# EAGLE design breakout_tag (EAGLE 5.11)
ABBREV: jn5; PROJECT: JeeNode v5
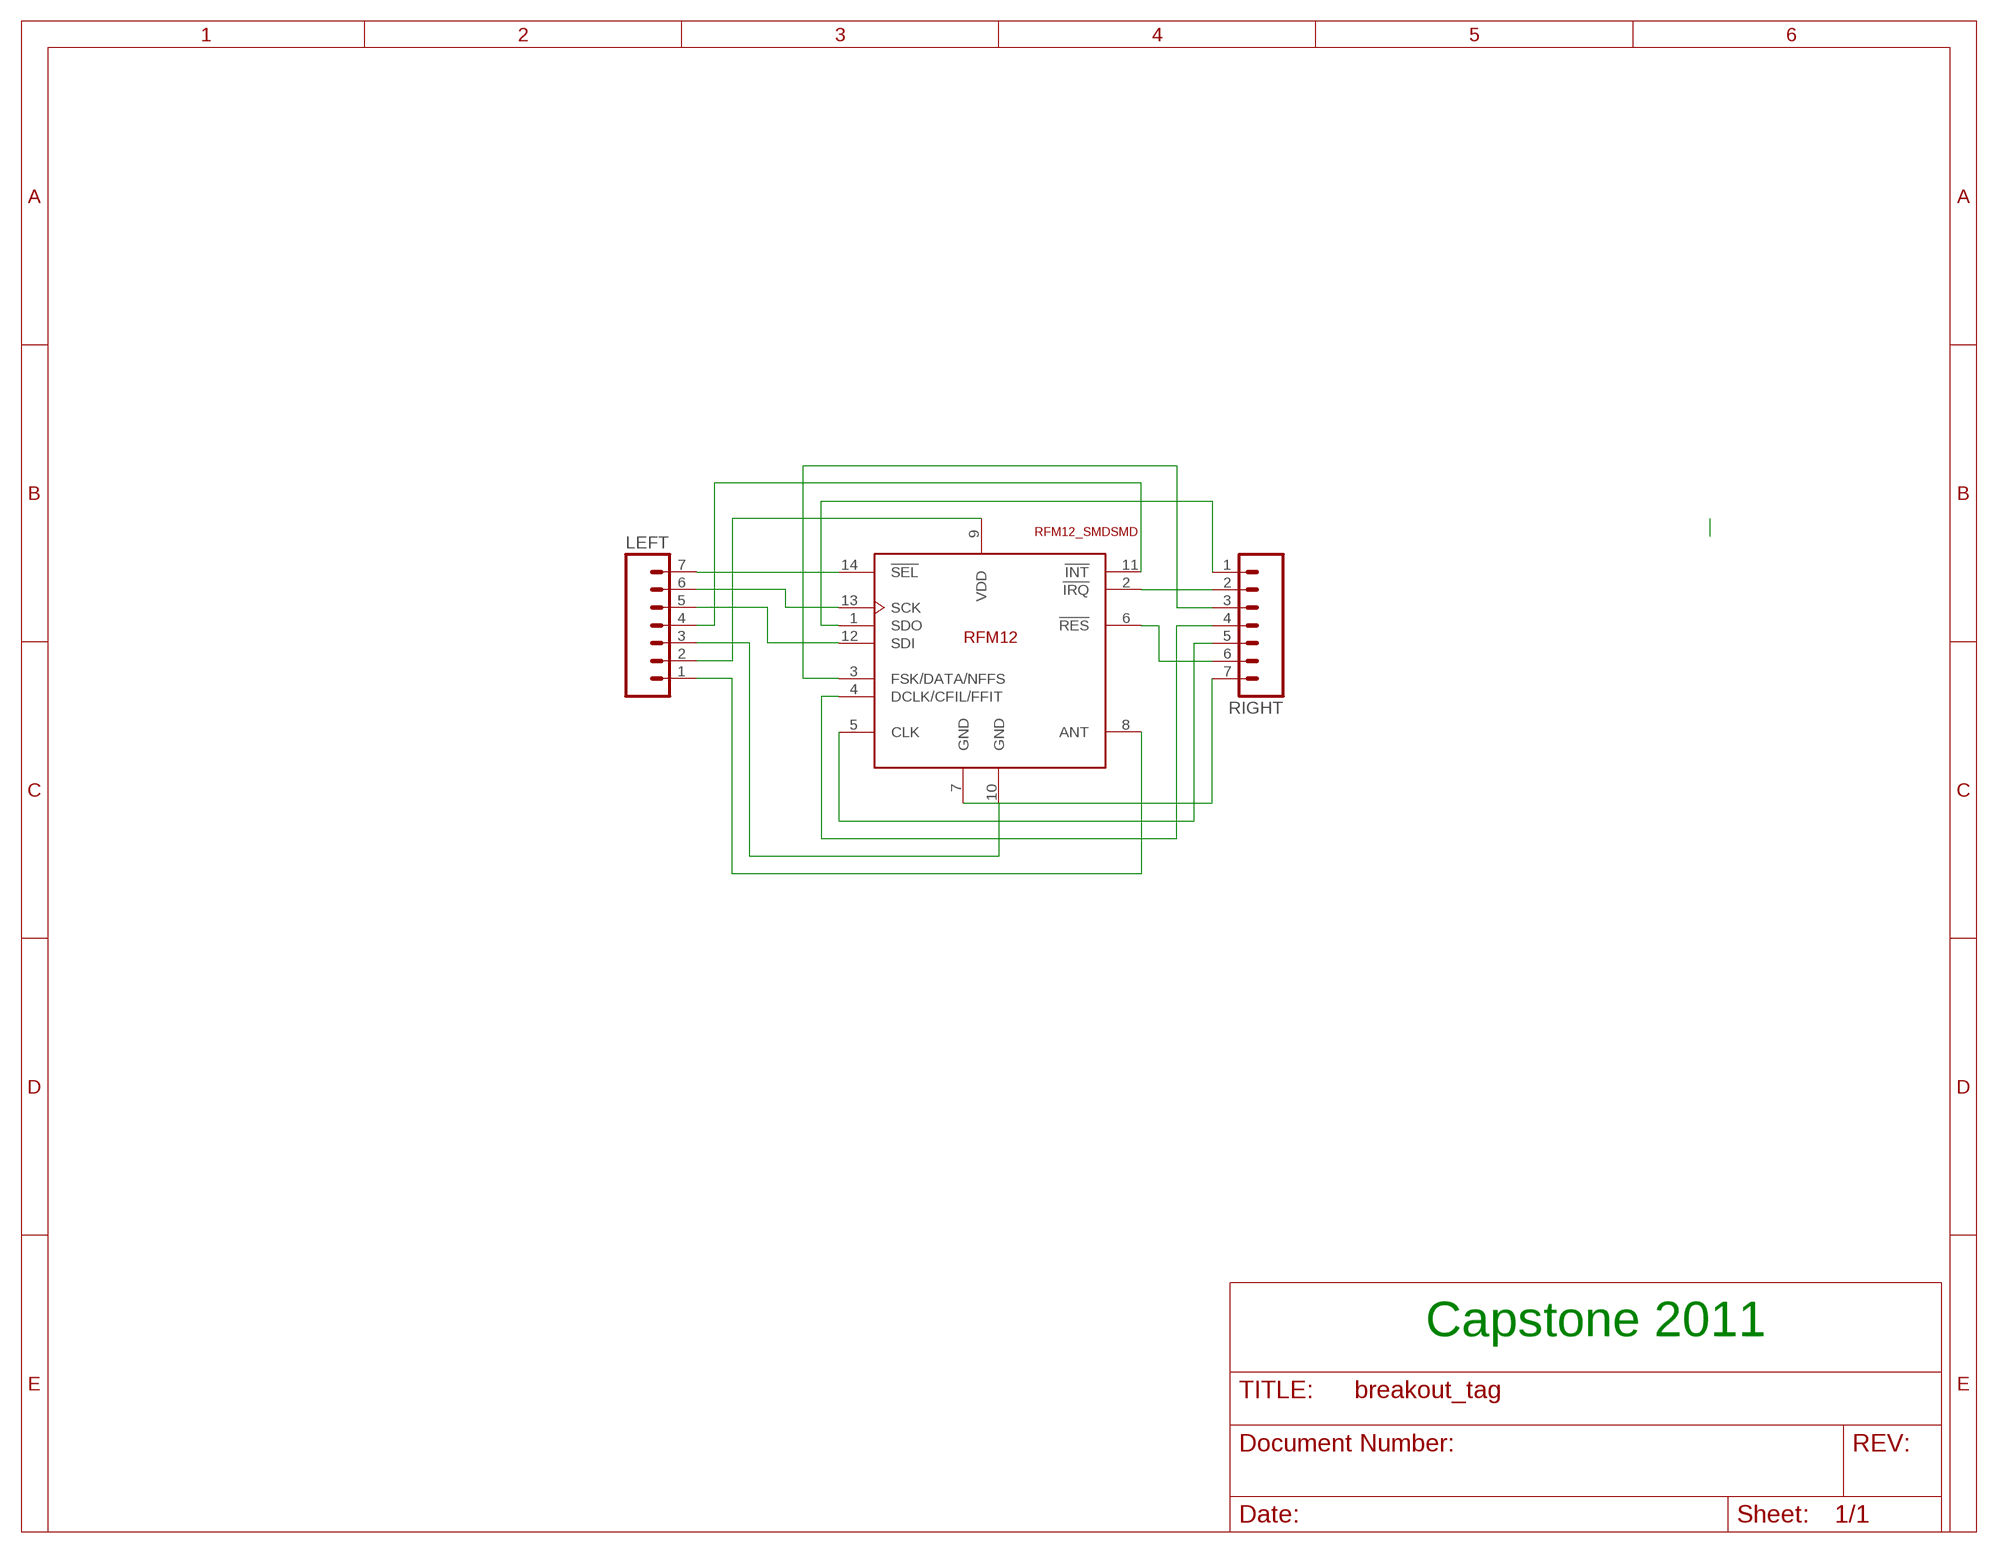
[diagram p0: schematic, sheet 1]

## Parts
LEFT  M07  [1X07]
RIGHT  M07  [1X07]
U$1  RFM12_SMDSMD  [RFM12]

## Nets
N$2: LEFT.7 U$1.14(!SEL)
N$3: LEFT.6 U$1.13(SCK)
N$4: LEFT.5 U$1.12(SDI)
N$5: LEFT.3 U$1.10(GND)
N$6: LEFT.1 U$1.8(ANT)
N$7: RIGHT.1 U$1.1(SDO)
N$8: RIGHT.2 U$1.2(!IRQ)
N$9: RIGHT.7 U$1.7(GND)
N$10: LEFT.4 U$1.11(!INT)
N$11: RIGHT.6 U$1.6(!RES)
N$12: RIGHT.5 U$1.5(CLK)
N$13: RIGHT.4 U$1.4(DCLK/CFIL/FFIT)
N$14: RIGHT.3 U$1.3(FSK/DATA/NFFS)
VDD: LEFT.2 U$1.9(VDD)

## Notes on the sheet
- Capstone 2011

## Library data of the parts
LEFT RIGHT = M7_02mm:M07: Header 7 Standard 7-pin 0.1" header. Use with straight break away headers (SKU : PRT-00116), right angle break away headers (PRT-00553), swiss pins (PRT-00743), machine pins (PRT-00117), and female headers (PRT-00115). NOTES ON THE VARIANTS LOCK and LOCK_LONGPADS... This footprint was designed to help hold the alignment of a through-hole component (i.e. 7-pin header) while soldering it into place. You may notice that each hole has been shifted either up or down by 0.005 of an inch from it's more standard position (which is usually a perfectly straight line). This slight alteration caused the pins (the squares in the middle) to touch the edges of the holes. Because they are alternating, it causes a "brace" to hold the header in place. 0.005 has proven to be the perfect amount of "off-center" position when using our standard breakaway headers. Although looks a little odd when you look at the bare footprint, once you have a header in there, the alteration is very hard to notice. Also, if you push a header all the way into place, it is covered up entirely on the bottom side. This idea of altering the position of holes to aid alignment will be further integrated into the Sparkfun Library for other footprints. It can help hold any component with 3 or more connection pins.
U$1 = rfm_12:RFM12_SMD: RFM12 is a low costing ISM band transceiver module implemented with unique PLL. It works signal ranges from 315/433/868/915MHZ bands, comply with FCC, ETSI regulation. The SPI interface is used to communicate with microcontroller for parameter setting.

## Net classes
1 power: width 0.381 mm, clearance 0.254 mm

## Board
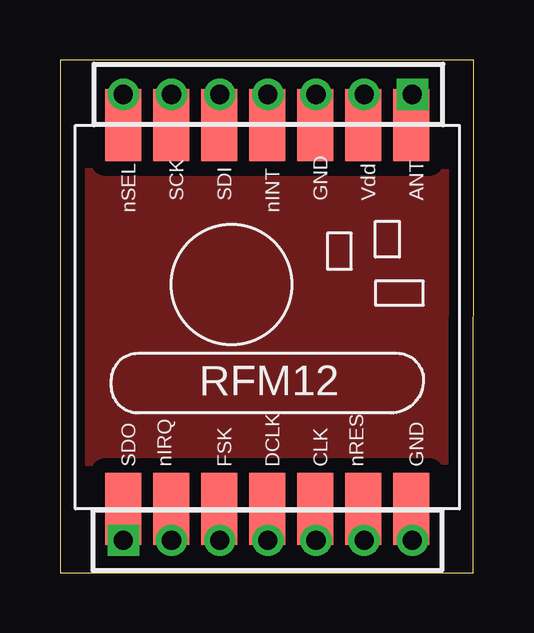
[diagram p1: board, top side]
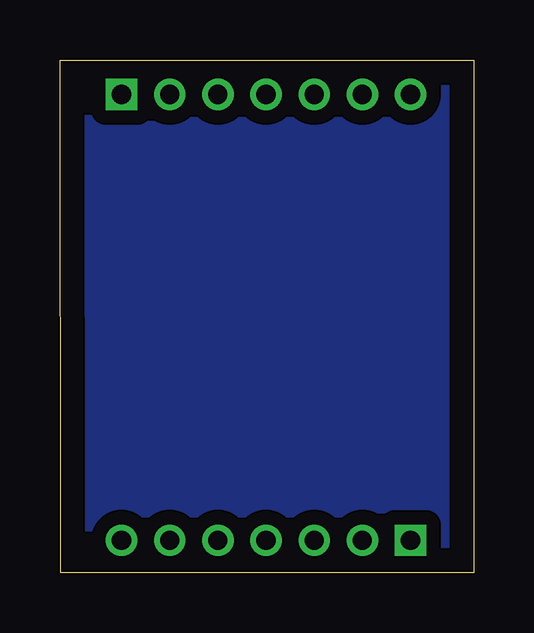
[diagram p2: board, bottom side, seen from below]

Size 17.25 x 21.38 mm. Coordinates in mm from the lower left corner, seen from the top.
Outline: 0,0 17.22,0 17.25,21.38 0,21.38 0,0
Copper layers (1*16): Top 0.035mm / dielectric 1.5mm / Bottom 0.035mm
Design rules "default": minimum track width 10mil, minimum drill 24mil, track to track 8mil, track to pad 8mil, pad to pad 8mil, via to via 8mil, smd to smd 8mil, copper to edge 40mil, drill to drill 8mil, minimum pad ring 10mil, minimum via ring 8mil, stop-mask expansion 4mil, vias tented up to drill 0mil, thermal gap 10mil

### Footprints (pad centres in the part's own frame; a part is rotated, then mirrored left to right if it is on the bottom)
1X07 = drill 0.8 square: 1 0,0 | drill 0.8 round: 2 2.007,0; 3 4.013,0; 4 6.02,0; 5 8.026,0; 6 10.033,0; 7 12.04,0
RFM12 = smd 1.5 x 3: 1 -5,-10; 2 -3,-10; 3 -1,-10; 4 1,-10; 5 3,-10; 6 5,-10; 7 7,-10; 8 7,6; 9 5,6; 10 3,6; 11 1,6; 12 -1,6; 13 -3,6; 14 -5,6

### Placement (x,y rotation side)
LEFT  14.68,19.94 180 top
RIGHT  2.64,1.35 0 top
U$1  7.65,12.65 0 top

### Tracks (layer width: path | path; a pad name or v marks a point on that pad's centre or on a via)
GND
  pour Bottom (isolate 0.61): 0.03,21.39 17.22,21.39 17.22,0.03 0,0.03 0,21.39
  pour Top (isolate 0.61): 0.05,21.34 17.25,21.34 17.25,0 0,0 0,21.39
N$2
  Top 0.813: U$1.14 2.62,18.65 LEFT.7
N$3
  Top 0.813: U$1.13 4.62,18.65 LEFT.6
N$4
  Top 0.813: U$1.12 6.63,18.65 LEFT.5
N$5
  Top 0.813: U$1.10 LEFT.3
N$6
  Top 0.813: U$1.8 LEFT.1
N$7
  Top 0.813: U$1.1 RIGHT.1
N$8
  Top 0.813: U$1.2 RIGHT.2
N$9
  Top 0.813: U$1.7 14.68,2.65 RIGHT.7
N$10
  Top 0.813: U$1.11 8.64,18.65 LEFT.4
N$11
  Top 0.813: U$1.6 12.68,2.65 RIGHT.6
N$12
  Top 0.813: U$1.5 10.67,2.65 RIGHT.5
N$13
  Top 0.813: U$1.4 RIGHT.4
N$14
  Top 0.813: U$1.3 RIGHT.3
VDD
  Top 0.813: U$1.9 LEFT.2